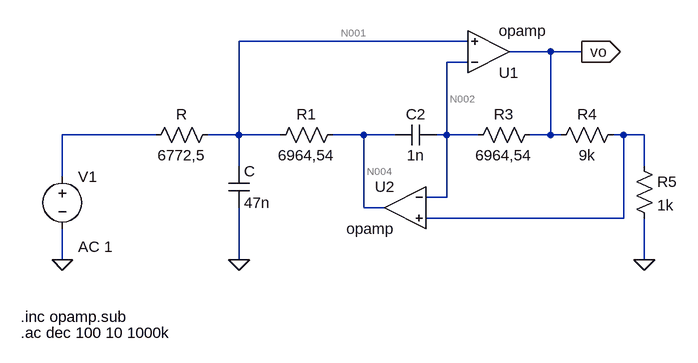
[diagram p0: schematic tarea1_ltspice.asc]
tarea1_ltspice.asc, the LTspice schematic file:
Version 4
SHEET 1 880 680
WIRE 240 64 -112 64
WIRE 368 80 304 80
WIRE 416 80 368 80
WIRE 240 96 208 96
WIRE -240 208 -384 208
WIRE -112 208 -112 64
WIRE -112 208 -160 208
WIRE -48 208 -112 208
WIRE 80 208 32 208
WIRE 128 208 80 208
WIRE 208 208 208 96
WIRE 208 208 192 208
WIRE 256 208 208 208
WIRE 368 208 368 80
WIRE 368 208 336 208
WIRE 384 208 368 208
WIRE 480 208 464 208
WIRE 512 208 480 208
WIRE -112 256 -112 208
WIRE 512 256 512 208
WIRE -384 272 -384 208
WIRE 208 304 208 208
WIRE 208 304 176 304
WIRE 80 320 80 208
WIRE 112 320 80 320
WIRE 480 336 480 208
WIRE 480 336 176 336
WIRE -384 400 -384 352
WIRE -112 400 -112 320
WIRE 512 400 512 336
FLAG 512 400 0
FLAG -112 400 0
FLAG -384 400 0
FLAG 416 80 vo
IOPIN 416 80 Out
SYMBOL OpAmps\\opamp 272 144 M180
SYMATTR InstName U1
SYMBOL OpAmps\\opamp 144 256 M0
SYMATTR InstName U2
SYMBOL res 48 192 R90
WINDOW 0 0 56 VBottom 2
WINDOW 3 32 56 VTop 2
SYMATTR InstName R1
SYMATTR Value 6964,54
SYMBOL cap -128 256 R0
SYMATTR InstName C
SYMATTR Value 47n
SYMBOL cap 192 192 R90
WINDOW 0 0 32 VBottom 2
WINDOW 3 32 32 VTop 2
SYMATTR InstName C2
SYMATTR Value 1n
SYMBOL res -144 192 R90
WINDOW 0 0 56 VBottom 2
WINDOW 3 32 56 VTop 2
SYMATTR InstName R
SYMATTR Value 6772,5
SYMBOL res 352 192 R90
WINDOW 0 0 56 VBottom 2
WINDOW 3 32 56 VTop 2
SYMATTR InstName R3
SYMATTR Value 6964,54
SYMBOL res 480 192 R90
WINDOW 0 0 56 VBottom 2
WINDOW 3 32 56 VTop 2
SYMATTR InstName R4
SYMATTR Value 9k
SYMBOL res 496 240 R0
SYMATTR InstName R5
SYMATTR Value 1k
SYMBOL voltage -384 256 R0
WINDOW 123 24 124 Left 2
WINDOW 39 0 0 Left 0
SYMATTR Value2 AC 1
SYMATTR InstName V1
SYMATTR Value ""
TEXT -448 488 Left 2 !.inc opamp.sub
TEXT -448 512 Left 2 !.ac dec 100 10 1000k

The netlist it stands for:
* tarea1_ltspice.asc
XU1 N002 N001 vo opamp Aol=100K GBW=10Meg  ; pins invin noninvin out
XU2 N002 N005 N004 opamp Aol=100K GBW=10Meg  ; pins invin noninvin out
R1 N004 N001 6964,54
C N001 0 47n
C2 N002 N004 1n
R N001 N003 6772,5
R3 vo N002 6964,54
R4 N005 vo 9k
R5 N005 0 1k
V1 N003 0 AC 1
.inc opamp.sub
.ac dec 100 10 1000k
.backanno
.end

* Results of the author's LTspice run, read from the files saved beside the schematic
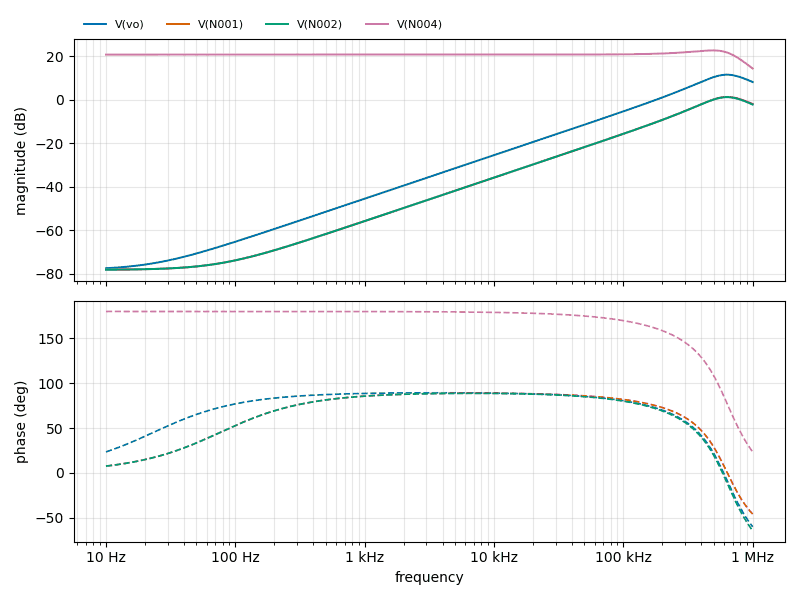
[diagram p1: AC Analysis of tarea1_ltspice.asc, plotted from the saved traces]
* AC Analysis, 1 run:
*   V(vo): -77.52 dB at 10 Hz, 8.06 dB at 1 MHz, peak 11.43 dB at 631 kHz, 3 dB below the peak at 410.9 kHz and 967.8 kHz
*   V(N001): -78.18 dB at 10 Hz, -2.04 dB at 1 MHz, peak 1.20 dB at 631 kHz, 3 dB below the peak at 412.8 kHz and 978.4 kHz
*   V(N002): -78.18 dB at 10 Hz, -2.28 dB at 1 MHz, peak 1.11 dB at 631 kHz, 3 dB below the peak at 410.7 kHz and 966.6 kHz
*   V(N004): 20.67 dB at 10 Hz, 14.27 dB at 1 MHz, peak 22.59 dB at 489.8 kHz, 3 dB below the peak at 748.3 kHz